# Altium schematic sheet Acond_Elec.SchDoc: CSN Detector V5
size A4; Author: RCP; DrawnBy: RCP; Address1: LIM-HGGM; Address3: RCP; DocumentNumber: 1; Revision: 1; SheetNumber: 1; SheetTotal: 2; PageSetup: Record=PageOptions|CenterHorizontal=True|CenterVertical=True|PrintScale=0.97|XCorrection=1.00|YCorrection=1.00|PrintKind=0|BorderSize=5000000|LeftOffset=0|BottomOffset=0|Orientation=2|PaperLength=2970|PaperWidth=2100|Scale=100|PaperSource=7|PrintQuality=600|MediaType=1|DitherType=10|PaperKind=A4|PrintScaleMode=1
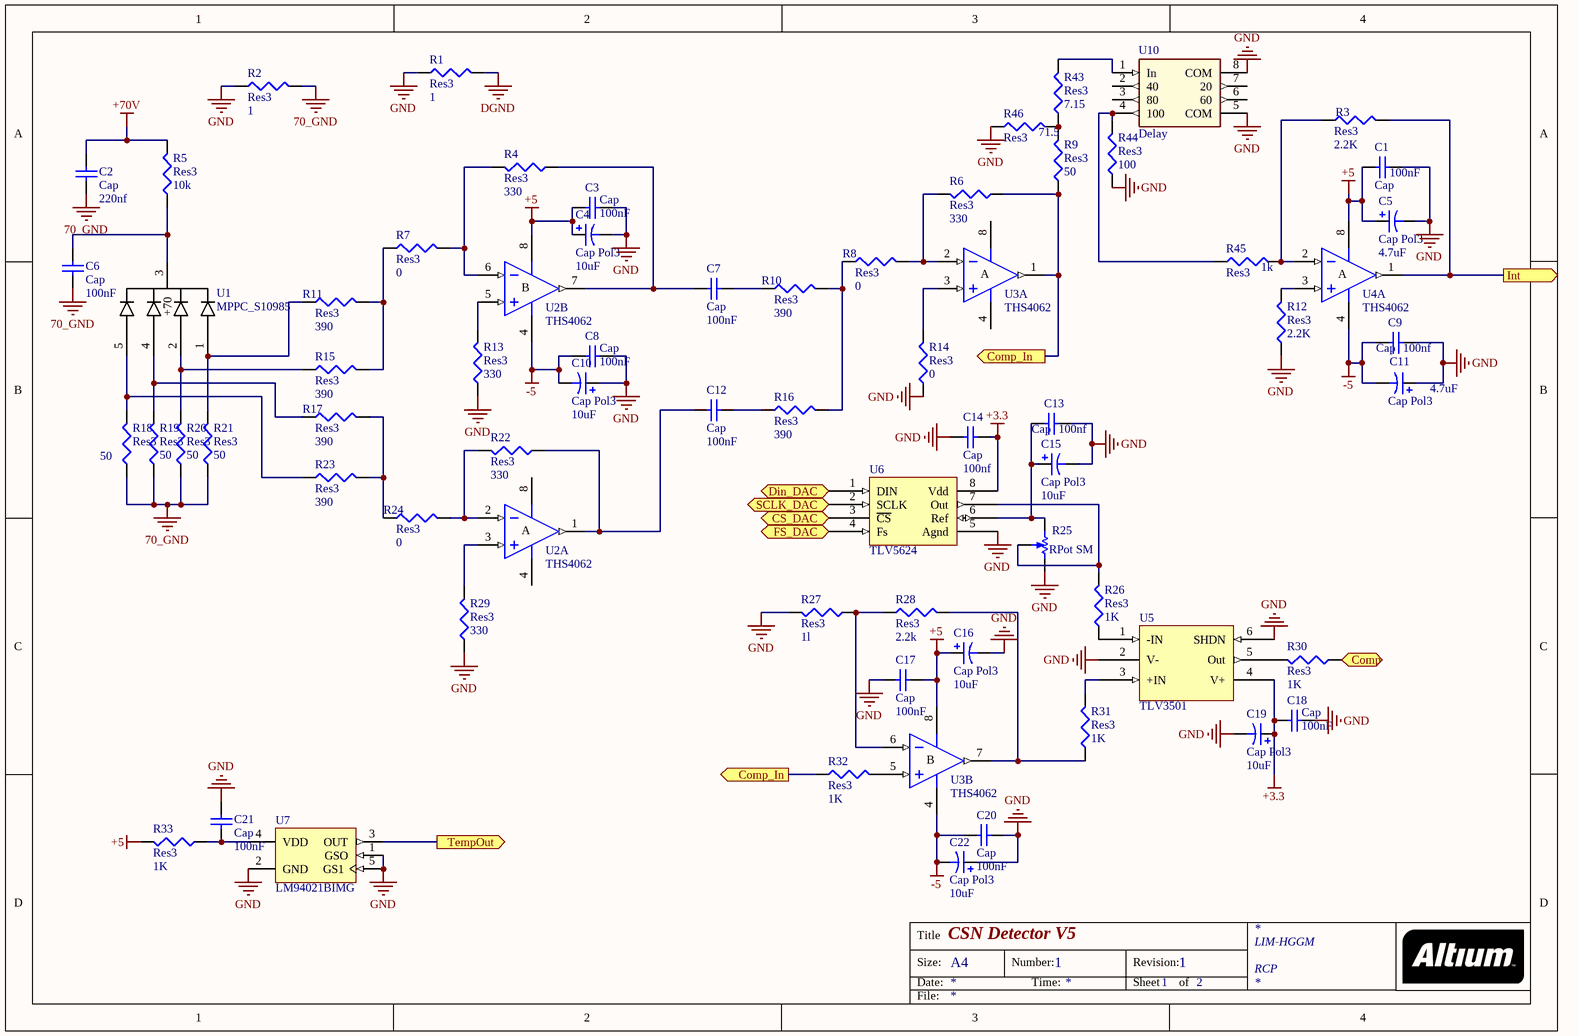
[diagram p0: Acond_Elec.SchDoc]

## Parts
C1  Cap  value 100nF  [J1-0603]
C2  Cap  value 220nf  [C0805]
C3  Cap  value 100nF  [J1-0603]
C4  Cap Pol3  value 10uF  [6-0805_N]
C5  Cap Pol3  value 4.7uF  [6-0805_N]
C6  Cap  value 100nF  [C0805]
C7  Cap  value 100nF  [J1-0603]
C8  Cap  value 100nF  [J1-0603]
C9  Cap  value 100nf  [J1-0603]
C10  Cap Pol3  value 10uF  [6-0805_N]
C11  Cap Pol3  value 4.7uF  [6-0805_N]
C12  Cap  value 100nF  [J1-0603]
C13  Cap  value 100nf  [J1-0603]
C14  Cap  value 100nf  [J1-0603]
C15  Cap Pol3  value 10uF  [6-0805_N]
C16  Cap Pol3  value 10uF  [6-0805_N]
C17  Cap  value 100nF  [J1-0603]
C18  Cap  value 100nF  [J1-0603]
C19  Cap Pol3  value 10uF  [6-0805_N]
C20  Cap  value 100nF  [J1-0603]
C21  Cap  value 100nF  [6-0805_N]
C22  Cap Pol3  value 10uF  [6-0805_N]
R1  Res3  value 1  [J1-0603]
R2  Res3  value 1  [J1-0603]
R3  Res3  value 2.2K  [J1-0603]
R4  Res3  value 330  [J1-0603]
R5  Res3  value 10k  [J1-0603]
R6  Res3  value 330  [J1-0603]
R7  Res3  value 0  [J1-0603]
R8  Res3  value 0  [J1-0603]
R9  Res3  value 50  [J1-0603]
R10  Res3  value 390  [J1-0603]
R11  Res3  value 390  [J1-0603]
R12  Res3  value 2.2K  [J1-0603]
R13  Res3  value 330  [J1-0603]
R14  Res3  value 0  [J1-0603]
R15  Res3  value 390  [J1-0603]
R16  Res3  value 390  [J1-0603]
R17  Res3  value 390  [J1-0603]
R18  Res3  value 50  [J1-0603]
R19  Res3  value 50  [J1-0603]
R20  Res3  value 50  [J1-0603]
R21  Res3  value 50  [J1-0603]
R22  Res3  value 330  [J1-0603]
R23  Res3  value 390  [J1-0603]
R24  Res3  value 0  [J1-0603]
R25  RPot SM  [POT4MM-2]
R26  Res3  value 1K  [J1-0603]
R27  Res3  value 1l  [J1-0603]
R28  Res3  value 2.2k  [J1-0603]
R29  Res3  value 330  [J1-0603]
R30  Res3  value 1K  [J1-0603]
R31  Res3  value 1K  [J1-0603]
R32  Res3  value 1K  [J1-0603]
R33  Res3  value 1K  [J1-0603]
R43  Res3  value 7.15  [J1-0603]
R44  Res3  value 100  [J1-0603]
R45  Res3  value 1k  [J1-0603]
R46  Res3  value 71.5  [J1-0603]
U1  MPPC_S10985  [S10985_HAM]
U2  THS4062  [SO-8_N]  (parts A,B of 2)
U3  THS4062  [SO-8_N]  (parts A,B of 2)
U4  THS4062  [SO-8_N]  (part A of 2)
U5  TLV3501  [SOT23-6_N]
U6  TLV5624  [SO-8_N]
U7  LM94021BIMG  [MAA05A_N]
U10  Delay  [AMZ-G-SMD]

## Ports
Comp (out), Comp_In (out), CS_DAC (out), Din_DAC (out), FS_DAC (out), Int (out), SCLK_DAC (out), TempOut (out)

## Nets
70_GND: C2.1 C6.1 R2.2 R18.1 R19.1 R20.1 R21.1
+3.3: C14.1 C18.2 C19.1 U5.4(V+) U6.8(Vdd)
+5: C1.2 C3.2 C4.1 C5.1 C16.1 C17.2 R33.2 U2.8(V+) U3.8(V+) U4.8(V+)
+70V: C2.2 R5.2
-5: C8.2 C9.1 C10.2 C11.2 C20.1 C22.2 U2.4(V-) U3.4(V-) U4.4(V-)
DGND: R1.2
GND: C1.1 C3.1 C4.2 C5.2 C8.1 C9.2 C10.1 C11.1 C13.2 C14.2 C15.2 C16.2 C17.1 C18.1 C19.2 C20.2 C21.1 C22.1 R1.1 R2.1 R12.1 R13.1 R14.1 R25.CW(+) R27.2 R29.1 R44.1 R46.1 U5.2(V-) U5.6(SHDN) U6.5(Agnd) U7.1(GSO) U7.2(GND) U7.5(GS1) U10.5(COM) U10.8(COM)
Comp: R30.1 ; port Comp
Comp_In: R6.1 R9.1 R32.1 U3.1(OUT) ; port Comp_In
CS_DAC: U6.3(~{CS}) ; port CS_DAC
Din_DAC: U6.1(DIN) ; port Din_DAC
FS_DAC: U6.4(Fs) ; port FS_DAC
Int: R3.2 U4.1(OUT) ; port Int
SCLK_DAC: U6.2(SCLK) ; port SCLK_DAC
TempOut: U7.3(OUT) ; port TempOut
NetC6_2: C6.2 R5.1 U1.3(+70)
NetC7_1: C7.1 R4.1 U2.7(OUT)
NetC7_2: C7.2 R10.1
NetC12_1: C12.1 R22.1 U2.1(OUT)
NetC12_2: C12.2 R16.1
NetC13_1: C13.1 C15.1 R25.CCW(-) U6.6(Ref)
NetC21_2: C21.2 R33.1 U7.4(VDD)
NetR3_1: R3.1 R45.2 U4.2(IN-)
NetR4_2: R4.2 R7.2 U2.6(IN-)
NetR6_2: R6.2 R8.2 U3.2(IN-)
NetR7_1: R7.1 R11.2 R15.2
NetR8_1: R8.1 R10.2 R16.2
NetR9_2: R9.2 R43.1 R46.2
NetR11_1: R11.1 R21.2 U1.1(Pin1)
NetR12_2: R12.2 U4.3(IN+)
NetR13_2: R13.2 U2.5(IN+)
NetR14_2: R14.2 U3.3(IN+)
NetR15_1: R15.1 R20.2 U1.2(Pin2)
NetR17_1: R17.1 R19.2 U1.4
NetR17_2: R17.2 R23.2 R24.1
NetR18_2: R18.2 R23.1 U1.5
NetR22_2: R22.2 R24.2 U2.2(IN-)
NetR25_W: R25.W R26.2 U6.7(Out)
NetR26_1: R26.1 U5.1(-IN)
NetR27_1: R27.1 R28.1 U3.6(IN-)
NetR28_2: R28.2 R31.1 U3.7(OUT)
NetR29_2: R29.2 U2.3(IN+)
NetR30_2: R30.2 U5.5(Out)
NetR31_2: R31.2 U5.3(+IN)
NetR32_2: R32.2 U3.5(IN+)
NetR43_2: R43.2 U10.1(In)
NetR44_2: R44.2 R45.1 U10.4(100)

Not connected (* = marked no-connect by the designer): U10 2(40) 3(80) 6(60) 7(20)

## Notes on the sheet
- Title
- Size:
- Date:
- A4
- Number:
- Time:
- Revision:
- Sheet
- of
- File:
- (in symbol AD8002AR, part A) A
- (in symbol AD8002AR, part B) B

## Library data of the parts
C1-C3 C6-C9 C12-C14 C17 C18 C20 C21 = Cap: Capacitor; Published: 8-Jun-2000; LatestRevisionDate: 17-Jul-2002; LatestRevisionNote: Re-released for DXP Platform.; PackageReference: RAD-0.3; Publisher: Altium Limited; PackageDescription: Radial Cap, Thru-Hole; 2 Leads; 0.3 in Pin Spacing
C4 C5 C10 C11 C15 C16 C19 C22 = Cap Pol3: Polarized Capacitor (Surface Mount); Published: 8-Jun-2000; LatestRevisionDate: 29-May-2009; LatestRevisionNote: IPC-7351 Footprint Added.; PackageReference: C0805; Publisher: Altium Limited; PackageDescription: Chip Capacitor
R1-R24 R26-R33 R43-R46 = Res3: Resistor; Published: 8-Jun-2000; LatestRevisionDate: 29-May-2009; LatestRevisionNote: IPC-7351 Footprint Added.; PackageReference: J1-0603; Publisher: Altium Limited; PackageDescription: Chip Resistor
R25 = RPot SM: Square Trimming Potentiometer; Published: 17-Dec-2003; DatasheetVersion: Oct-2003; PackageReference: POT4MM-2; Publisher: Altium Limited; PackageDescription: Square Trimming Potentiometer; ComponentLink1Description: Manufacturer Link; ComponentLink1URL: http://bourns.com/2/search.html
U2-U4 = AD8002AR: Dual 600MHz, 50mW Current Feedback Amplifier; Published: 8-Jun-2000; LatestRevisionDate: 13-Apr-2006; LatestRevisionNote: IPC-7351 Footprint Added.; DatasheetVersion: REV. C 1999; PackageVersion: revA; PackageReference: SO-8; Publisher: Altium Limited; PackageDescription: 8-Pin Small Outline Integrated Circuit 1.27 mm Pitch; Code_JEDEC: MS-012-AA; Code_IPC: SOIC127P600-8; ComponentLink1Description: Manufacturer Link; ComponentLink1URL: http://www.analog.com/en/prod/0,,759_786_AD8002%2C00.html; ComponentLink2Description: Datasheet; ComponentLink2URL: http://www.analog.com/UploadedFiles/Data_Sheets/147523773AD8002_d.pdf
U5 = TLV3501: Analog Comparator
U6 = TLV5624: DAC, internal reference, SPI
U7 = LM94021BIMG: Multi-Gain Analog Temperature Sensor, 5-pin SC-70; Manufacturer: National Semiconductor; PackageTopMarking: 21B*XTT; PowerWise: Y; CompType: Temp Sensor IC; Published: 4-Dec-2008; DatasheetVersion: Feb-2010; PackageVersion: revD, Jun-2007; PackageReference: MAA05A; Publisher: Altium Limited; PackageDescription: Molded SC-70, 2 x 1.25 x .9mm, 5 Lead, 0.65mm Pitch; Supplier 1: Farnell; Supplier Part Number 1: 1047766; PartNumber: LM94021BIMG; RoHS: N; PinCount: 5; Code_JEITA: SC-88A; Code_JEDEC: MO-203-AA; Code_IPC: SOT353-5; ComponentLink1Description: LM94021 Datasheet; ComponentLink1URL: http://www.national.com/ds/LM/LM94021.pdf; ComponentLink2Description: LM94021 Web Page; ComponentLink2URL: http://www.national.com/pf/LM/LM94021.html; ComponentLink3Description: MAA05A Package Page; ComponentLink3URL: http://www.national.com/packaging/folders/maa05a.html
U10 = AMZ-601G